# EAGLE schematic main_board (EAGLE 9.6.2)
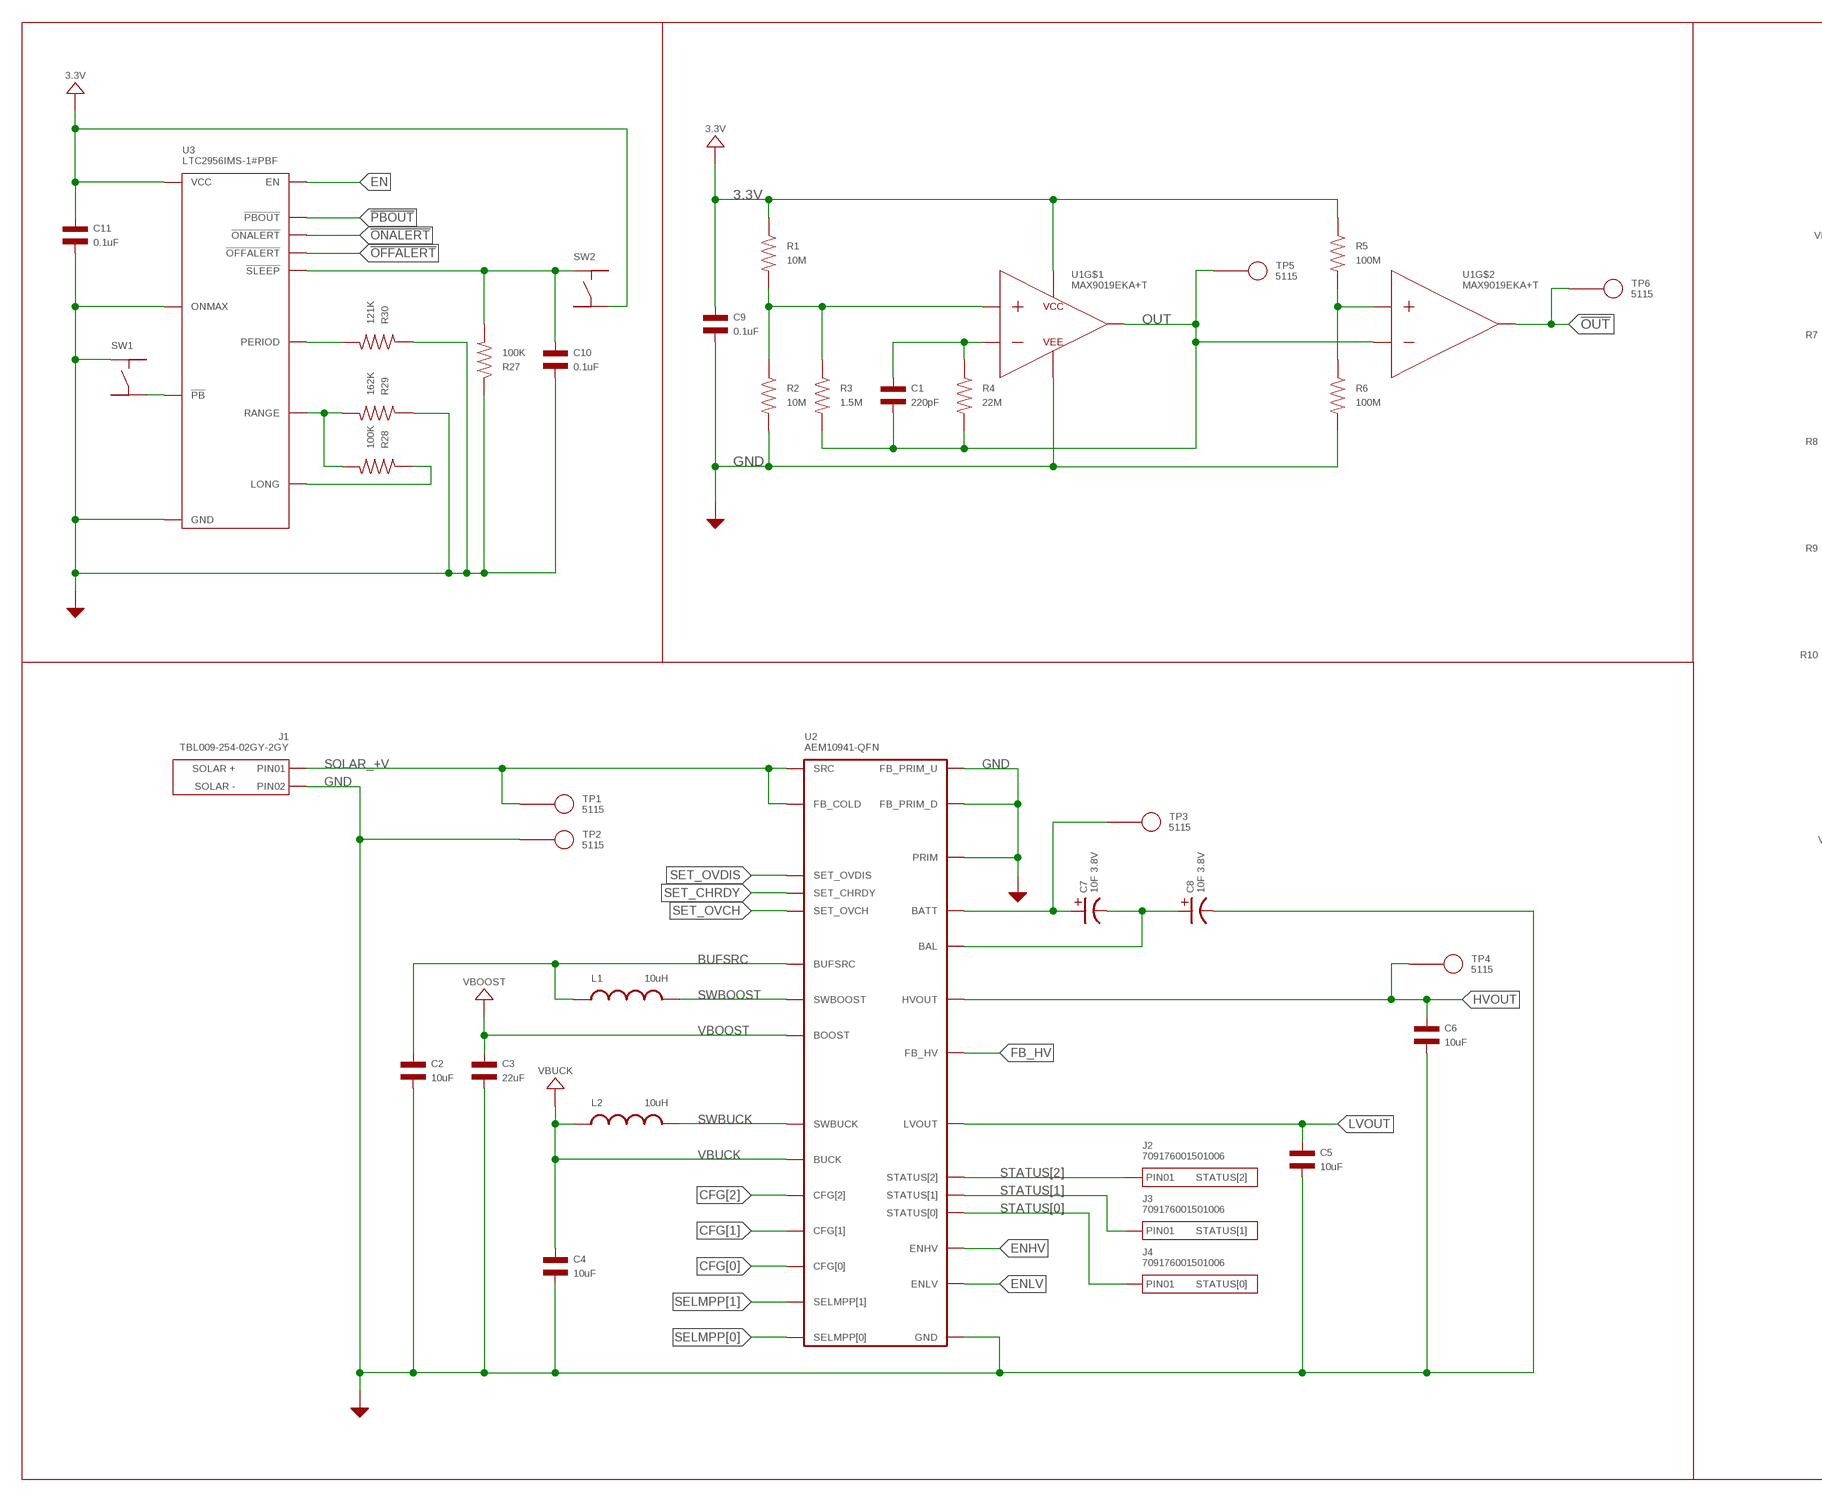
[diagram p0: schematic, sheet 1, part 1 of 2]
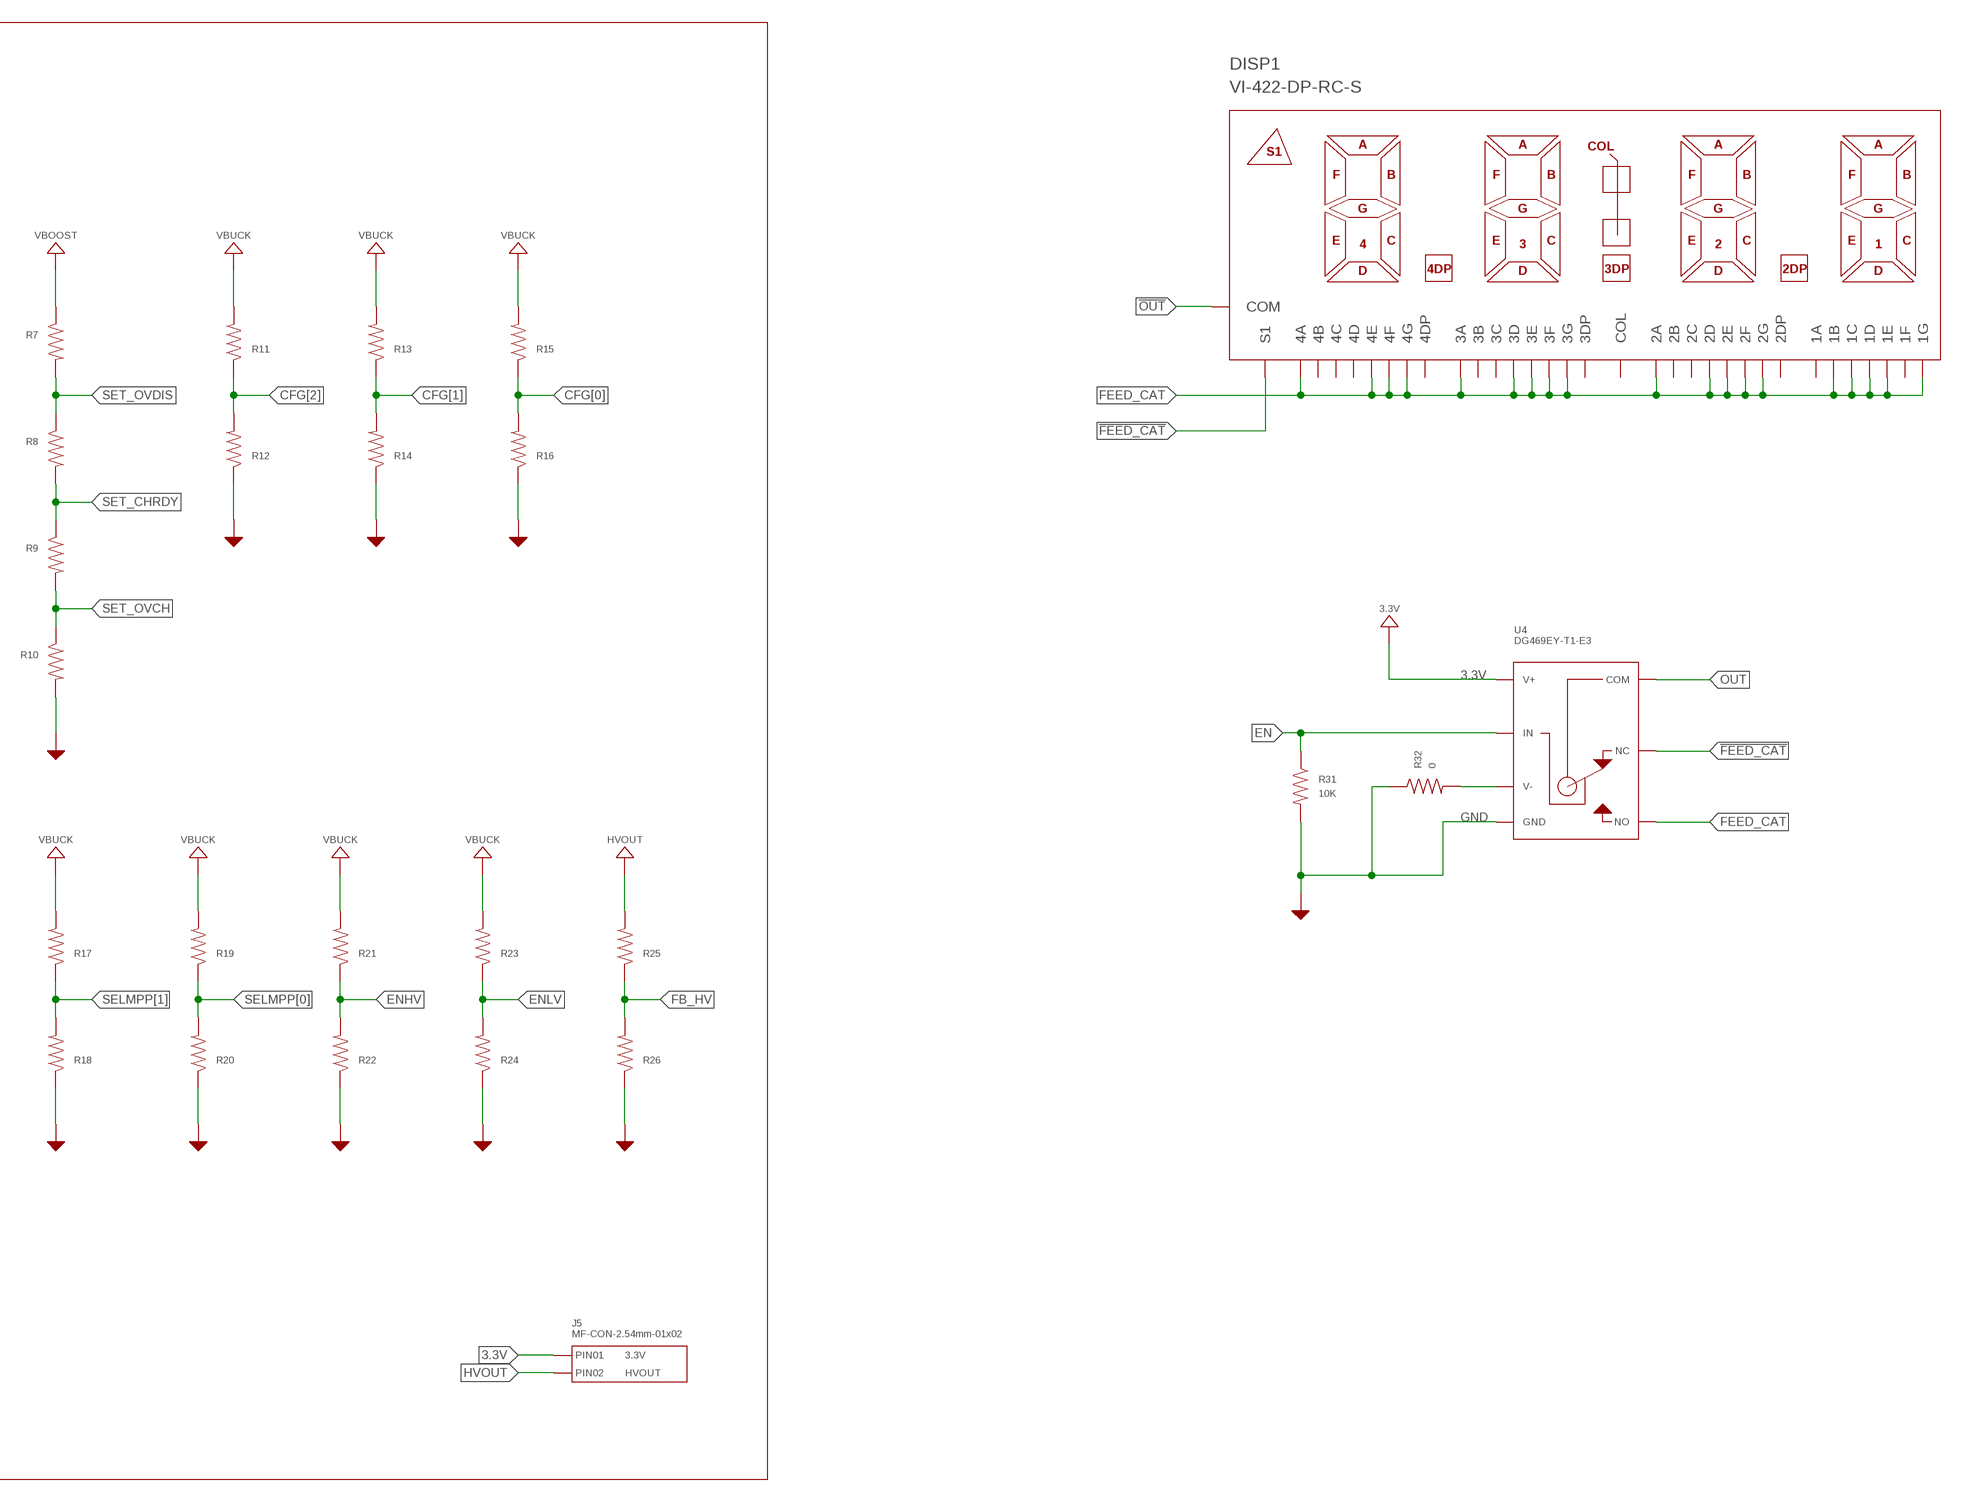
[diagram p1: schematic, sheet 1, part 2 of 2]

## Parts
C1  220pF  CAPACITOR_NP_0805  [C0805]
C2  10uF  CAPACITOR_NP_0603  [C0603]
C3  22uF  CAPACITOR_NP_0603  [C0603]
C4  10uF  CAPACITOR_NP_0603  [C0603]
C5  10uF  CAPACITOR_NP_0603  [C0603]
C6  10uF  CAPACITOR_NP_0603  [C0603]
C7  10F 3.8V  CAPACITOR_POLARIZED_12.5MM_PTH  [12.5MM_CAP_PTH]
C8  10F 3.8V  CAPACITOR_POLARIZED_12.5MM_PTH  [12.5MM_CAP_PTH]
C9  0.1uF  CAPACITOR_NP_0603  [C0603]
C10  0.1uF  CAPACITOR_NP_0603  [C0603]
C11  0.1uF  CAPACITOR_NP_0603  [C0603]
DISP1  VI-422-DP-RC-S  [VI-422-DP-RC-S]
J1  TBL009-254-02GY-2GY  CON_01X02_TBL009-254-02GY-2GY  [TBL009-254-02GY-2GY]
J2  709176001501006  CON_01X01_709176001501006  [709176001501006]
J3  709176001501006  CON_01X01_709176001501006  [709176001501006]
J4  709176001501006  CON_01X01_709176001501006  [709176001501006]
J5  MF-CON-2.54mm-01x02  CON_01X02_PTH_2.54MM  [PTH_2.54MM_01X02]
L1  10uH  INDUCTORLPS4012  [LPS4012]
L2  10uH  INDUCTOR_0603  [0603]
R1  10M  RESISTOR_0805  [R0805]
R2  10M  RESISTOR_0805  [R0805]
R3  1.5M  RESISTOR_0805  [R0805]
R4  22M  RESISTOR_0805  [R0805]
R5  100M  RESISTOR_0805  [R0805]
R6  100M  RESISTOR_0805  [R0805]
R7  RESISTOR_0805  [R0805]
R8  RESISTOR_0805  [R0805]
R9  RESISTOR_0805  [R0805]
R10  RESISTOR_0805  [R0805]
R11  RESISTOR_0805  [R0805]
R12  RESISTOR_0805  [R0805]
R13  RESISTOR_0805  [R0805]
R14  RESISTOR_0805  [R0805]
R15  RESISTOR_0805  [R0805]
R16  RESISTOR_0805  [R0805]
R17  RESISTOR_0805  [R0805]
R18  RESISTOR_0805  [R0805]
R19  RESISTOR_0805  [R0805]
R20  RESISTOR_0805  [R0805]
R21  RESISTOR_0805  [R0805]
R22  RESISTOR_0805  [R0805]
R23  RESISTOR_0805  [R0805]
R24  RESISTOR_0805  [R0805]
R25  RESISTOR_0805  [R0805]
R26  RESISTOR_0805  [R0805]
R27  100K  RESISTOR_0805  [R0805]
R28  100K  RESISTOR_0805  [R0805]
R29  162K  RESISTOR_0805  [R0805]
R30  121K  RESISTOR_0805  [R0805]
R31  10K  RESISTOR_0805  [R0805]
R32  0  RESISTOR_0805  [R0805]
SW1  TACT_4.2MM  [TACT4.2MM]
SW2  TACT_4.2MM  [TACT4.2MM]
TP1  5115  TEST_POINT_SINGLE_KEYSTONE_5115-5119  [KEYSTONE_5115-5119]
TP2  5115  TEST_POINT_SINGLE_KEYSTONE_5115-5119  [KEYSTONE_5115-5119]
TP3  5115  TEST_POINT_SINGLE_KEYSTONE_5115-5119  [KEYSTONE_5115-5119]
TP4  5115  TEST_POINT_SINGLE_KEYSTONE_5115-5119  [KEYSTONE_5115-5119]
TP5  5115  TEST_POINT_SINGLE_KEYSTONE_5115-5119  [KEYSTONE_5115-5119]
TP6  5115  TEST_POINT_SINGLE_KEYSTONE_5115-5119  [KEYSTONE_5115-5119]
U1  MAX9019EKA+T  MAX9019  [MAX9019EKA+T]
U2  AEM10941-QFN  AEM10941  [AEM10941_QFN-28]
U3  LTC2956IMS-1#PBF  [LTC2956_MSOP-12]
U4  DG469EY-T1-E3  [DG469_SOIC-8]

## Nets
3.3V: C9.P$1 C11.P$1 J5.P$1(PIN1) R1.P$1 R5.P$1 SW2.P$4 U1.P$8(VCC) U3.P$5(VCC) U4.P$4(V+)
!FEED_CAT: DISP1.P$38(S1) U4.P$2(NC)
!OFFALERT: U3.P$10(!OFFALERT)
!ONALERT: U3.P$12(!ONALERT)
!OUT: DISP1.P$1(COM) DISP1.P$40(COM) TP6.P$1 U1.P$7(OUTPUT_2)
!PB: SW1.P$4 U3.P$7(!PB)
!PBOUT: U3.P$9(!PBOUT)
!SLEEP: C10.P$1 R27.P$2 SW2.P$1 U3.P$11(!SLEEP)
BAL: C7.NEG C8.POS U2.P$15(BAL)
BATT: C7.POS TP3.P$1 U2.P$16(BATT)
BUFSRC: C2.P$1 L1.P$2 U2.P$27(BUFSRC)
CFG[0]: R15.P$1 R16.P$2 U2.P$6(CFG[0])
CFG[1]: R13.P$1 R14.P$2 U2.P$5(CFG[1])
CFG[2]: R11.P$1 R12.P$2 U2.P$4(CFG[2])
EN: R31.P$1 U3.P$8(EN) U4.P$6(IN)
ENHV: R21.P$1 R22.P$2 U2.P$12(ENHV)
ENLV: R23.P$1 R24.P$2 U2.P$18(ENLV)
FB_HV: R25.P$1 R26.P$2 U2.P$13(FB_HV)
FEED_CAT: DISP1.P$5(4E) DISP1.P$9(3E) DISP1.P$10(3D) DISP1.P$13(2E) DISP1.P$14(2D) DISP1.P$17(1E) DISP1.P$18(1D) DISP1.P$19(1C) DISP1.P$20(1B) DISP1.P$23(1G) DISP1.P$25(2A) DISP1.P$26(2F) DISP1.P$27(2G) DISP1.P$30(3A) DISP1.P$31(3F) DISP1.P$32(3G) DISP1.P$35(4A) DISP1.P$36(4F) DISP1.P$37(4G) U4.P$8(NO)
GND: C2.P$2 C3.P$2 C4.P$2 C5.P$2 C6.P$2 C8.NEG C9.P$2 C10.P$2 C11.P$2 J1.2A(PIN2) J1.2B(PIN2) R2.P$2 R6.P$2 R10.P$2 R12.P$1 R14.P$1 R16.P$1 R18.P$1 R20.P$1 R22.P$1 R24.P$1 R26.P$1 R27.P$1 R29.P$1 R30.P$1 R31.P$2 R32.P$1 SW1.P$1 TP2.P$1 U1.P$4(VEE) U2.P$9(FB_PRIM_D) U2.P$10(FB_PRIM_U) U2.P$17(PRIM) U2.P$29(GND) U3.P$1(ONMAX) U3.P$6(GND) U4.P$3(GND)
HVOUT: C6.P$1 J5.P$2(PIN2) R25.P$2 TP4.P$1 U2.P$14(HVOUT)
LONG: R28.P$1 U3.P$2(LONG)
LVOUT: C5.P$1 U2.P$11(LVOUT)
N$1: R1.P$2 R2.P$1 R3.P$1 U1.P$3(INPUT_1+)
N$2: R5.P$2 R6.P$1 U1.P$5(INPUT_2+)
N$3: C1.P$1 R4.P$1 U1.P$2(INPUT_1-)
N$4: R32.P$2 U4.P$7(V-)
OUT: C1.P$2 R3.P$2 R4.P$2 TP5.P$1 U1.P$1(OUTPUT_1) U1.P$6(INPUT_2-) U4.P$1(COM)
PERIOD: R30.P$2 U3.P$4(PERIOD)
RANGE: R28.P$2 R29.P$2 U3.P$3(RANGE)
SELMPP[0]: R19.P$1 R20.P$2 U2.P$8(SELMPP[0])
SELMPP[1]: R17.P$1 R18.P$2 U2.P$7(SELMPP[1])
SET_CHRDY: R8.P$2 R9.P$1 U2.P$23(SET_CHRDY)
SET_OVCH: R9.P$2 R10.P$1 U2.P$22(SET_OVCH)
SET_OVDIS: R7.P$2 R8.P$1 U2.P$24(SET_OVDIS)
SOLAR_+V: J1.1A(PIN1) J1.1B(PIN1) TP1.P$1 U2.P$25(SRC) U2.P$26(FB_COLD)
STATUS[0]: J4.P$1(PIN1) U2.P$21(STATUS[0])
STATUS[1]: J3.P$1(PIN1) U2.P$20(STATUS[1])
STATUS[2]: J2.P$1(PIN1) U2.P$19(STATUS[2])
SWBOOST: L1.P$1 U2.P$28(SWBOOST)
SWBUCK: L2.1 U2.P$2(SWBUCK)
VBOOST: C3.P$1 R7.P$1 U2.P$1(BOOST)
VBUCK: C4.P$1 L2.2 R11.P$2 R13.P$2 R15.P$2 R17.P$2 R19.P$2 R21.P$2 R23.P$2 U2.P$3(BUCK)
Unconnected: DISP1.P$6(4D) DISP1.P$7(4C) DISP1.P$8(4DP) DISP1.P$11(3C) DISP1.P$12(3DP) DISP1.P$15(2C) DISP1.P$16(2DP) DISP1.P$21(1A) DISP1.P$22(1F) DISP1.P$24(2B) DISP1.P$28(COL) DISP1.P$29(3B) DISP1.P$34(4B) SW1.P$2 SW1.P$3 SW2.P$2 SW2.P$3

## Library data of the parts
C1 C9-C11 = MF_Passives:CAPACITOR_NP: Library: MF_Passives Description: Device for Non-Polarized Capacitors. Manufacture part number (MPN) can be added via Attributes. Check https://factory.macrofab.com/parts for the house parts list.; POPULATE: 1
C2 C4-C6 = MF_Passives:CAPACITOR_NP: Library: MF_Passives Description: Device for Non-Polarized Capacitors. Manufacture part number (MPN) can be added via Attributes. Check https://factory.macrofab.com/parts for the house parts list.; MPN: C1608X5R1A106M080AC; POPULATE: 1
C3 = MF_Passives:CAPACITOR_NP: Library: MF_Passives Description: Device for Non-Polarized Capacitors. Manufacture part number (MPN) can be added via Attributes. Check https://factory.macrofab.com/parts for the house parts list.; MPN: GRM188R61A226ME15D; POPULATE: 1
C7 C8 = PP_Passives:CAPACITOR_POLARIZED: Polarized capacitors; MPN: HSL0814-3R8106-R
DISP1 = PP_Displays:VI-422-DP-RC-S; MPN: VI-422-DP-RC-S
J1 = PP_Connectors:CON_01X02; LABEL01: SOLAR +; LABEL02: SOLAR -; MPN: TBL009-254-02GY-2GY
J2 = PP_Connectors:CON_01X01; LABEL01: STATUS[2]
J3 = PP_Connectors:CON_01X01; LABEL01: STATUS[1]
J4 = PP_Connectors:CON_01X01; LABEL01: STATUS[0]
J5 = MF_Connectors:CON_01X02: Library: MF_Connectors Description: Header Connector with 02 Positions and 01 Rows. Use the LABEL Attribute to label the pin on the schematic and PCB. You can remove the attributes on the PCB by using the SMASH function on the part and then deleting the text.; HOUSEPART: YES; LABEL01: 3.3V; LABEL02: HVOUT; MPN: MF-CON-2.54mm-01x02; POPULATE: 1; URL: https://factory.macrofab.com/part/MF-CON-2.54mm-01x02
L1 = PP_Passives:INDUCTOR: Inductors; MPN: LPS4012-103MRC
L2 = PP_Passives:INDUCTOR: Inductors; MPN: MLZ1608M100WT
R1-R6 = MF_Passives:RESISTOR: Library: MF_Passives Description: Device for Resistors. Manufacture part number (MPN), Voltage, Tolerance, and Wattage Rating can be added via Attributes. Check https://factory.macrofab.com/parts for the house parts list.; POPULATE: 1
R7-R26 R31 R32 = MF_Passives:RESISTOR: Library: MF_Passives Description: Device for Resistors. Manufacture part number (MPN), Voltage, Tolerance, and Wattage Rating can be added via Attributes. Check https://factory.macrofab.com/parts for the house parts list.; POPULATE: 0
R27 = MF_Passives:RESISTOR: Library: MF_Passives Description: Device for Resistors. Manufacture part number (MPN), Voltage, Tolerance, and Wattage Rating can be added via Attributes. Check https://factory.macrofab.com/parts for the house parts list.; HOUSEPART: ERA-3ARB104V; POPULATE: 0
R28 = MF_Passives:RESISTOR: Library: MF_Passives Description: Device for Resistors. Manufacture part number (MPN), Voltage, Tolerance, and Wattage Rating can be added via Attributes. Check https://factory.macrofab.com/parts for the house parts list.; MPN: ERA-3ARB104V; POPULATE: 0
R29 = MF_Passives:RESISTOR: Library: MF_Passives Description: Device for Resistors. Manufacture part number (MPN), Voltage, Tolerance, and Wattage Rating can be added via Attributes. Check https://factory.macrofab.com/parts for the house parts list.; MPN: ERA-3AEB1623V; POPULATE: 0
R30 = MF_Passives:RESISTOR: Library: MF_Passives Description: Device for Resistors. Manufacture part number (MPN), Voltage, Tolerance, and Wattage Rating can be added via Attributes. Check https://factory.macrofab.com/parts for the house parts list.; MPN: ERA-3AEB1213V; POPULATE: 0
SW1 SW2 = MF_Switches:TACT: Library: MF_Switches Description: Device for Tact Switches. Manufacture part number (MFG#) can be added via Attributes.; HOUSEPART: YES; MPN: PTS810 SJM 250 SMTR LFS; POPULATE: 1; URL: https://factory.macrofab.com/part/MF-SW-TACT-4.2MM; VALUE: MF-SW-TACT-4.2MM
TP1 = PP_Connectors:TEST_POINT_SINGLE; LABEL01: SOLAR V+; POPULATE: 1
TP2 = PP_Connectors:TEST_POINT_SINGLE; LABEL01: GND; POPULATE: 1
TP3 = PP_Connectors:TEST_POINT_SINGLE; LABEL01: CAP V+; POPULATE: 1
TP4 = PP_Connectors:TEST_POINT_SINGLE; LABEL01: HVOUT; POPULATE: 1
TP5 = PP_Connectors:TEST_POINT_SINGLE; LABEL01: OUT; POPULATE: 1
TP6 = PP_Connectors:TEST_POINT_SINGLE; LABEL01: !OUT; POPULATE: 1
U1 = PP_AnalogIC:MAX9019
U2 = PP_PowerIC:AEM10941; MPN: AEM10941
U3 = PP_DigitalIC:LTC2956IMS-1#PBF; MPN: LTC2956IMS-1#PBF; POPULATE: 1
U4 = PP_AnalogIC:DG469